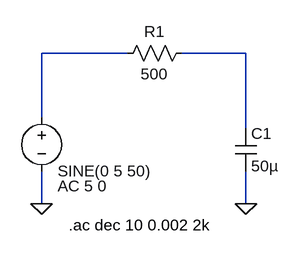
[diagram p0: schematic Elecfest-lowpassfilter.asc]
Elecfest-lowpassfilter.asc, the LTspice schematic file:
Version 4
SHEET 1 880 680
WIRE 352 224 224 224
WIRE 528 224 432 224
WIRE 224 320 224 224
WIRE 528 336 528 224
WIRE 224 448 224 400
WIRE 528 448 528 400
FLAG 224 448 0
FLAG 528 448 0
SYMBOL Voltage 224 304 R0
WINDOW 0 24 16 Invisible 2
WINDOW 123 24 118 Left 2
SYMATTR InstName V1
SYMATTR Value SINE(0 5 50)
SYMATTR Value2 AC 5 0
SYMBOL Res 448 208 R90
WINDOW 0 0 56 VBottom 2
WINDOW 3 32 56 VTop 2
SYMATTR InstName R1
SYMATTR Value 500
SYMBOL Cap 512 336 R0
SYMATTR InstName C1
SYMATTR Value 50µ
TEXT 264 480 Left 2 !.ac dec 10 0.002 2k

The netlist it stands for:
* Elecfest-lowpassfilter.asc
V1 N001 0 SINE(0 5 50) AC 5 0
R1 N002 N001 500
C1 N002 0 50µ
.ac dec 10 0.002 2k
.backanno
.end